# EAGLE design stm32f0discovery_ext (EAGLE 7.3.0)
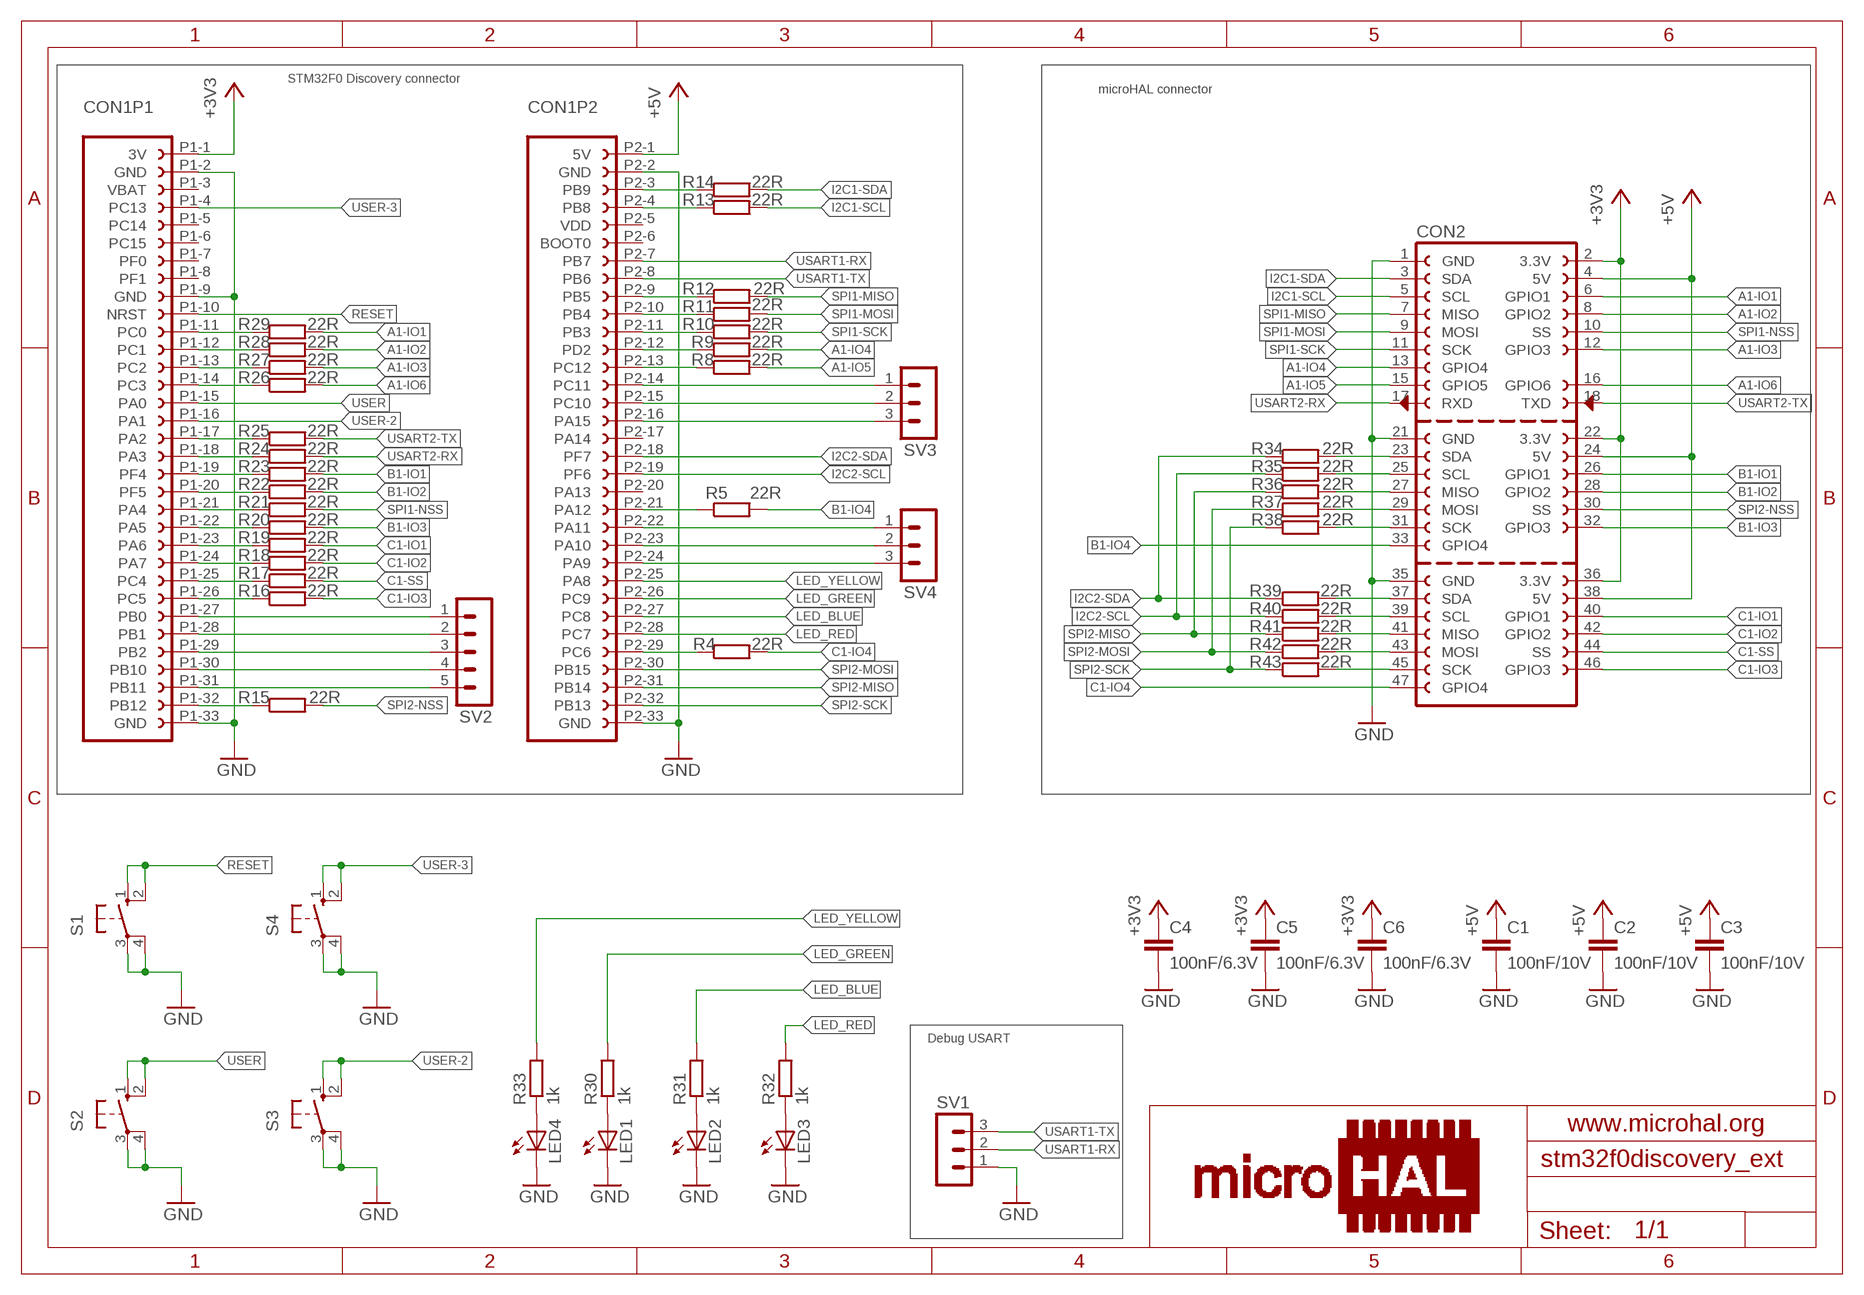
[diagram p0: schematic, sheet 1]

## Parts
C1  100nF/10V  C-EUC0603K  [C0603K]
C2  100nF/10V  C-EUC0603K  [C0603K]
C3  100nF/10V  C-EUC0603K  [C0603K]
C4  100nF/6.3V  C-EUC0603K  [C0603K]
C5  100nF/6.3V  C-EUC0603K  [C0603K]
C6  100nF/6.3V  C-EUC0603K  [C0603K]
CON1  STM32F0-DISCOVERY  [STM32F0-DISCOVERY-CONNECTOR]
CON2  MICROHAL_CONNECTOR_F_3  [MICROHAL_CONNECTOR_F_3]
LED1  LEDCHIPLED_0603  [CHIPLED_0603]
LED2  LEDCHIPLED_0603  [CHIPLED_0603]
LED3  LEDCHIPLED_0603  [CHIPLED_0603]
LED4  LEDCHIPLED_0603  [CHIPLED_0603]
R4  22R  R-EU_R0603  [R0603]
R5  22R  R-EU_R0603  [R0603]
R8  22R  R-EU_R0603  [R0603]
R9  22R  R-EU_R0603  [R0603]
R10  22R  R-EU_R0603  [R0603]
R11  22R  R-EU_R0603  [R0603]
R12  22R  R-EU_R0603  [R0603]
R13  22R  R-EU_R0603  [R0603]
R14  22R  R-EU_R0603  [R0603]
R15  22R  R-EU_R0603  [R0603]
R16  22R  R-EU_R0603  [R0603]
R17  22R  R-EU_R0603  [R0603]
R18  22R  R-EU_R0603  [R0603]
R19  22R  R-EU_R0603  [R0603]
R20  22R  R-EU_R0603  [R0603]
R21  22R  R-EU_R0603  [R0603]
R22  22R  R-EU_R0603  [R0603]
R23  22R  R-EU_R0603  [R0603]
R24  22R  R-EU_R0603  [R0603]
R25  22R  R-EU_R0603  [R0603]
R26  22R  R-EU_R0603  [R0603]
R27  22R  R-EU_R0603  [R0603]
R28  22R  R-EU_R0603  [R0603]
R29  22R  R-EU_R0603  [R0603]
R30  1k  R-EU_R0603  [R0603]
R31  1k  R-EU_R0603  [R0603]
R32  1k  R-EU_R0603  [R0603]
R33  1k  R-EU_R0603  [R0603]
R34  22R  R-EU_R0603  [R0603]
R35  22R  R-EU_R0603  [R0603]
R36  22R  R-EU_R0603  [R0603]
R37  22R  R-EU_R0603  [R0603]
R38  22R  R-EU_R0603  [R0603]
R39  22R  R-EU_R0603  [R0603]
R40  22R  R-EU_R0603  [R0603]
R41  22R  R-EU_R0603  [R0603]
R42  22R  R-EU_R0603  [R0603]
R43  22R  R-EU_R0603  [R0603]
S1  10-XX  [B3F-10XX]
S2  10-XX  [B3F-10XX]
S3  10-XX  [B3F-10XX]
S4  10-XX  [B3F-10XX]
SV1  MA03-1  [MA03-1]
SV2  MA05-1  [MA05-1]
SV3  MA03-1  [MA03-1]
SV4  MA03-1  [MA03-1]

## Nets
+3V3: C4.1 C5.1 C6.1 CON1.P1-1(P1:3V) CON2.2(3.3V) CON2.22(3.3V) CON2.36(3.3V)
+5V: C1.1 C2.1 C3.1 CON1.P2-1(P2:5V) CON2.4(5V) CON2.24(5V) CON2.38(5V)
A1-IO1: CON2.6(GPIO1) R29.2
A1-IO2: CON2.8(GPIO2) R28.2
A1-IO3: CON2.12(GPIO3) R27.2
A1-IO4: CON2.13(GPIO4) R9.2
A1-IO5: CON2.15(GPIO5) R8.2
A1-IO6: CON2.16(GPIO6) R26.2
B1-IO1: CON2.26(GPIO1) R23.2
B1-IO2: CON2.28(GPIO2) R22.2
B1-IO3: CON2.32(GPIO3) R20.2
B1-IO4: CON2.33(GPIO4) R5.2
C1-IO1: CON2.40(GPIO1) R19.2
C1-IO2: CON2.42(GPIO2) R18.2
C1-IO3: CON2.46(GPIO3) R16.2
C1-IO4: CON2.47(GPIO4) R4.2
C1-SS: CON2.44(SS) R17.2
GND: C1.2 C2.2 C3.2 C4.2 C5.2 C6.2 CON1.P1-2(P1:GND) CON1.P1-9(P1:GND) CON1.P1-33(P1:GND) CON1.P2-2(P2:GND) CON1.P2-33(P2:GND) CON2.1(GND) CON2.21(GND) CON2.35(GND) LED1.C LED2.C LED3.C LED4.C S1.3(P) S1.4(P1) S2.3(P) S2.4(P1) S3.3(P) S3.4(P1) S4.3(P) S4.4(P1) SV1.1
I2C1-SCL: CON2.5(SCL) R13.2
I2C1-SDA: CON2.3(SDA) R14.2
I2C2-SCL: CON1.P2-19(P2:PF6) R35.1 R40.1
I2C2-SDA: CON1.P2-18(P2:PF7) R34.1 R39.1
LED_BLUE: CON1.P2-27(P2:PC8) R31.2
LED_GREEN: CON1.P2-26(P2:PC9) R30.2
LED_RED: CON1.P2-28(P2:PC7) R32.2
LED_YELLOW: CON1.P2-25(P2:PA8) R33.2
N$4: CON1.P2-29(P2:PC6) R4.1
N$5: CON1.P2-21(P2:PA12) R5.1
N$8: CON1.P2-13(P2:PC12) R8.1
N$9: CON1.P2-12(P2:PD2) R9.1
N$10: CON1.P2-11(P2:PB3) R10.1
N$11: CON1.P2-10(P2:PB4) R11.1
N$13: CON1.P2-9(P2:PB5) R12.1
N$14: CON1.P2-4(P2:PB8) R13.1
N$15: CON1.P2-3(P2:PB9) R14.1
N$16: CON1.P1-32(P1:PB12) R15.1
N$17: CON1.P1-26(P1:PC5) R16.1
N$18: CON1.P1-25(P1:PC4) R17.1
N$19: CON1.P1-24(P1:PA7) R18.1
N$20: CON1.P1-23(P1:PA6) R19.1
N$21: CON1.P1-22(P1:PA5) R20.1
N$22: CON1.P1-21(P1:PA4) R21.1
N$23: CON1.P1-20(P1:PF5) R22.1
N$24: CON1.P1-19(P1:PF4) R23.1
N$25: CON1.P1-18(P1:PA3) R24.1
N$26: CON1.P1-17(P1:PA2) R25.1
N$27: CON1.P1-14(P1:PC3) R26.1
N$28: CON1.P1-13(P1:PC2) R27.1
N$29: CON1.P1-12(P1:PC1) R28.1
N$30: CON1.P1-11(P1:PC0) R29.1
N$31: LED1.A R30.1
N$32: LED2.A R31.1
N$33: LED3.A R32.1
N$34: LED4.A R33.1
N$35: CON1.P1-27(P1:PB0) SV2.1
N$36: CON1.P1-28(P1:PB1) SV2.2
N$37: CON1.P1-29(P1:PB2) SV2.3
N$38: CON1.P1-30(P1:PB10) SV2.4
N$39: CON1.P1-31(P1:PB11) SV2.5
N$40: CON1.P2-14(P2:PC11) SV3.1
N$41: CON1.P2-15(P2:PC10) SV3.2
N$42: CON1.P2-16(P2:PA15) SV3.3
N$43: CON1.P2-22(P2:PA11) SV4.1
N$44: CON1.P2-23(P2:PA10) SV4.2
N$45: CON1.P2-24(P2:PA9) SV4.3
N$46: CON2.23(SDA) R34.2
N$47: CON2.25(SCL) R35.2
N$48: CON2.27(MISO) R36.2
N$49: CON2.29(MOSI) R37.2
N$50: CON2.31(SCK) R38.2
N$51: CON2.37(SDA) R39.2
N$52: CON2.39(SCL) R40.2
N$53: CON2.41(MISO) R41.2
N$54: CON2.43(MOSI) R42.2
N$55: CON2.45(SCK) R43.2
RESET: CON1.P1-10(P1:NRST) S1.1(S) S1.2(S1)
SPI1-MISO: CON2.7(MISO) R12.2
SPI1-MOSI: CON2.9(MOSI) R11.2
SPI1-NSS: CON2.10(SS) R21.2
SPI1-SCK: CON2.11(SCK) R10.2
SPI2-MISO: CON1.P2-31(P2:PB14) R36.1 R41.1
SPI2-MOSI: CON1.P2-30(P2:PB15) R37.1 R42.1
SPI2-NSS: CON2.30(SS) R15.2
SPI2-SCK: CON1.P2-32(P2:PB13) R38.1 R43.1
USART1-RX: CON1.P2-7(P2:PB7) SV1.2
USART1-TX: CON1.P2-8(P2:PB6) SV1.3
USART2-RX: CON2.17(RXD) R24.2
USART2-TX: CON2.18(TXD) R25.2
USER: CON1.P1-15(P1:PA0) S2.1(S) S2.2(S1)
USER-2: CON1.P1-16(P1:PA1) S3.1(S) S3.2(S1)
USER-3: CON1.P1-4(P1:PC13) S4.1(S) S4.2(S1)
Unconnected: CON1.P1-3(P1:VBAT) CON1.P1-5(P1:PC14) CON1.P1-6(P1:PC15) CON1.P1-7(P1:PF0) CON1.P1-8(P1:PF1) CON1.P2-5(P2:VDD) CON1.P2-6(P2:BOOT0) CON1.P2-17(P2:PA14) CON1.P2-20(P2:PA13)

## Notes on the sheet
- STM32F0 Discovery connector
- microHAL connector
- Debug USART

## Library data of the parts
C1-C6 = rcl:C-EU: CAPACITOR, European symbol
CON1 = stm32f0discovery:STM32F0-DISCOVERY: FEMALE HEADER; OC_FARNELL: unknown; OC_NEWARK: unknown
CON2 = microhal-connector_v0.1:MICROHAL_CONNECTOR_F_3: Connector used in microhal development board.
LED1-LED4 = led:LED: LED OSRAM: - CHIPLED LG R971, LG N971, LY N971, LG Q971, LY Q971, LO R971, LY R971 LH N974, LH R974 LS Q976, LO Q976, LY Q976 LO Q996 - Hyper CHIPLED LW Q18S LB Q993, LB Q99A, LB R99A - SideLED LS A670, LO A670, LY A670, LG A670, LP A670 LB A673, LV A673, LT A673, LW A673 LH A674 LY A675 LS A676, LA A676, LO A676, LY A676, LW A676 LS A679, LY A679, LG A679 - Hyper Micro SIDELED® LS Y876, LA Y876, LO Y876, LY Y876 LT Y87S - SmartLED LW L88C, LW L88S LB L89C, LB L89S, LG L890 LS L89K, LO L89K, LY L89K LS L896, LA L896, LO L896, LY L896 - TOPLED LS T670, LO T670, LY T670, LG T670, LP T670 LSG T670, LSP T670, LSY T670, LOP T670, LYG T670 LG T671, LOG T671, LSG T671 LB T673, LV T673, LT T673, LW T673 LH T674 LS T676, LA T676, LO T676, LY T676, LB T676, LH T676, LSB T676, LW T676 LB T67C, LV T67C, LT T67C, LS T67K, LO T67K, LY T67K, LW E67C LS E67B, LA E67B, LO E67B, LY E67B, LB E67C, LV E67C, LT E67C LW T67C LS T679, LY T679, LG T679 LS T770, LO T770, LY T770, LG T770, LP T770 LB T773, LV T773, LT T773, LW T773 LH T774 LS E675, LA E675, LY E675, LS T675 LS T776, LA T776, LO T776, LY T776, LB T776 LHGB T686 LT T68C, LB T68C - Hyper Mini TOPLED® LB M676 - Mini TOPLED Santana® LG M470 LS M47K, LO M47K, LY M47K Source: http://www.osram.convergy.de LUXEON: - LUMILED® LXK2-PW12-R00, LXK2-PW12-S00, LXK2-PW14-U00, LXK2-PW14-V00 LXK2-PM12-R00, LXK2-PM12-S00, LXK2-PM14-U00 LXK2-PE12-Q00, LXK2-PE12-R00, LXK2-PE12-S00, LXK2-PE14-T00, LXK2-PE14-U00 LXK2-PB12-K00, LXK2-PB12-L00, LXK2-PB12-M00, LXK2-PB14-N00, LXK2-PB14-P00, LXK2-PB14-Q00 LXK2-PR12-L00, LXK2-PR12-M00, LXK2-PR14-Q00, LXK2-PR14-R00 LXK2-PD12-Q00, LXK2-PD12-R00, LXK2-PD12-S00 LXK2-PH12-R00, LXK2-PH12-S00 LXK2-PL12-P00, LXK2-PL12-Q00, LXK2-PL12-R00 Source: www.luxeon.com KINGBRIGHT: KA-3528ASYC Source: www.kingbright.com
R4 R5 R8-R43 = rcl:R-EU_: RESISTOR, European symbol
S1-S4 = switch-omron:10-XX: OMRON SWITCH; MPN: B3F-1000; OC_FARNELL: 176432; OC_NEWARK: 36M3542
SV1 SV3 SV4 = con-lstb:MA03-1: PIN HEADER; OC_FARNELL: unknown; OC_NEWARK: unknown
SV2 = con-lstb:MA05-1: PIN HEADER; OC_FARNELL: unknown; OC_NEWARK: unknown

## Board
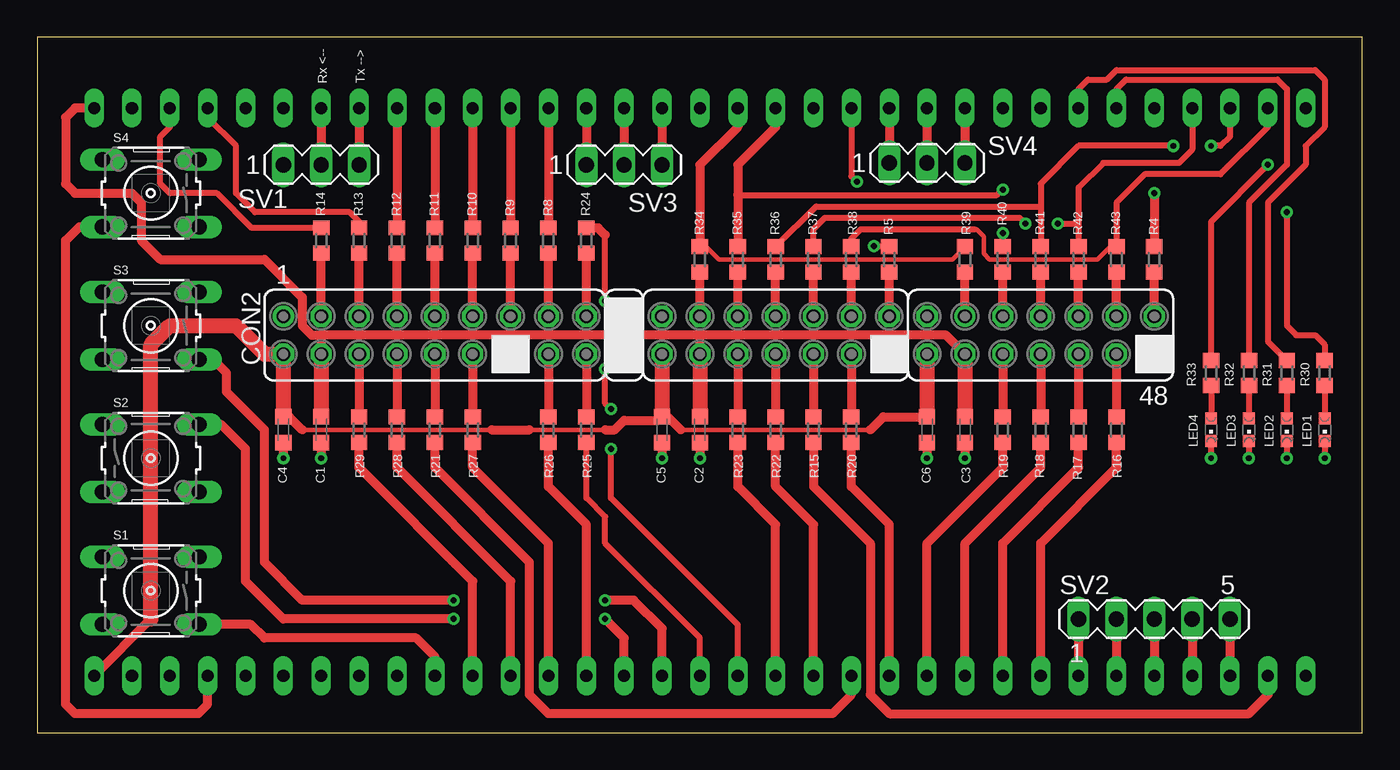
[diagram p1: board, top side]
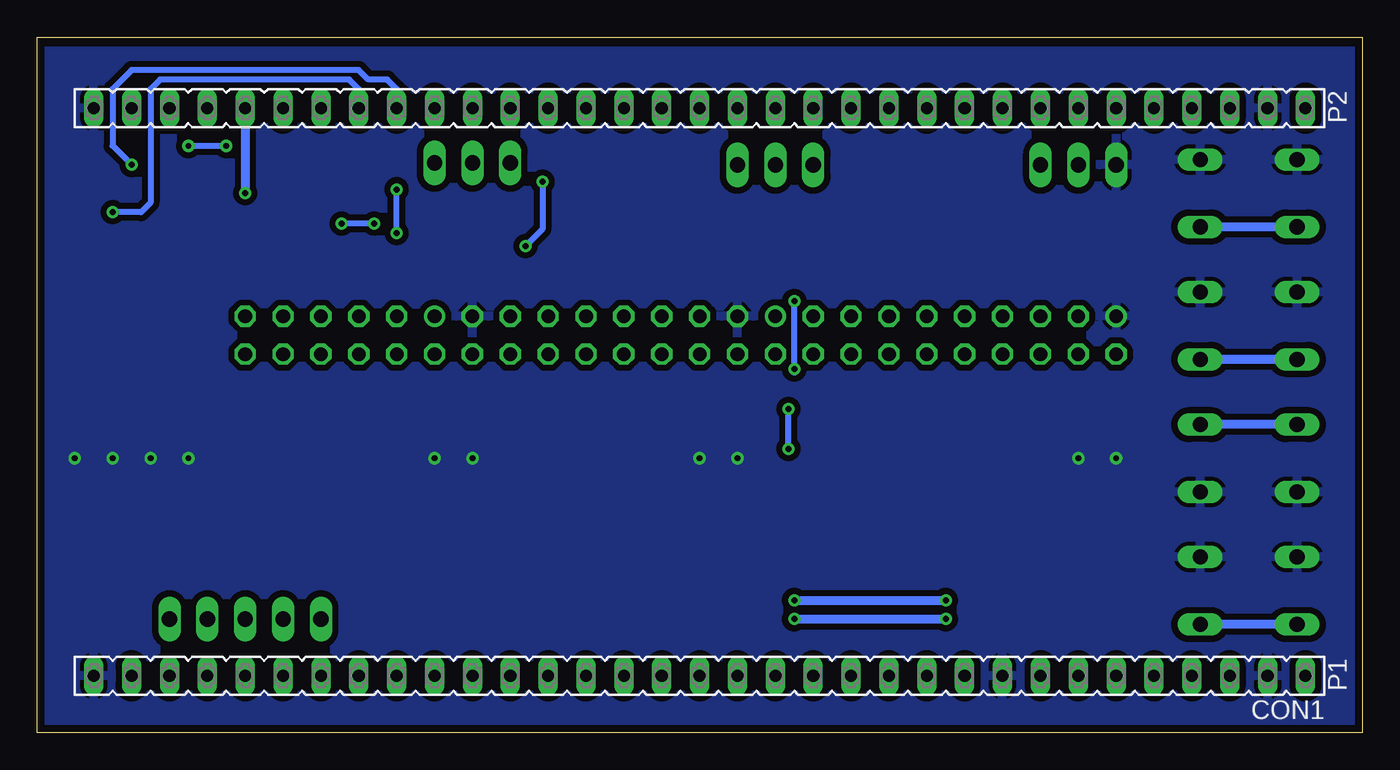
[diagram p2: board, bottom side, seen from below]

Size 88.88 x 46.66 mm. Coordinates in mm from the lower left corner, seen from the top.
Outline: 0,0 88.88,0 88.88,46.66 0,46.66 0,0
Copper layers (1*16): Top 0.035mm / dielectric 1.5mm / Bottom 0.035mm
Design rules "default *": minimum track width 8mil, minimum drill 14mil, track to track 8mil, track to pad 6mil, pad to pad 8mil, via to via 8mil, smd to smd 4mil, copper to edge 20mil, drill to drill 8mil, minimum pad ring 10mil, minimum via ring 8mil, stop-mask expansion 4mil, vias tented up to drill 16mil, thermal gap 10mil

### Footprints (pad centres in the part's own frame; a part is rotated, then mirrored left to right if it is on the bottom)
C0603K = smd 1.05 x 1.08: 1 -0.875,0; 2 0.875,0
STM32F0-DISCOVERY-CONNECTOR = drill 0.813 long: P1-1 19.05,40.64; P1-2 19.05,38.1; P1-3 19.05,35.56; P1-4 19.05,33.02; P1-5 19.05,30.48; P1-6 19.05,27.94; P1-7 19.05,25.4; P1-8 19.05,22.86; P1-9 19.05,20.32; P1-10 19.05,17.78; P1-11 19.05,15.24; P1-12 19.05,12.7; P1-13 19.05,10.16; P1-14 19.05,7.62; P1-15 19.05,5.08; P1-16 19.05,2.54; P1-17 19.05,0; P1-18 19.05,-2.54; P1-19 19.05,-5.08; P1-20 19.05,-7.62; P1-21 19.05,-10.16; P1-22 19.05,-12.7; P1-23 19.05,-15.24; P1-24 19.05,-17.78; P1-25 19.05,-20.32; P1-26 19.05,-22.86; P1-27 19.05,-25.4; P1-28 19.05,-27.94; P1-29 19.05,-30.48; P1-30 19.05,-33.02; P1-31 19.05,-35.56; P1-32 19.05,-38.1; P1-33 19.05,-40.64; P2-1 -19.05,40.64; P2-2 -19.05,38.1; P2-3 -19.05,35.56; P2-4 -19.05,33.02; P2-5 -19.05,30.48; P2-6 -19.05,27.94; P2-7 -19.05,25.4; P2-8 -19.05,22.86; P2-9 -19.05,20.32; P2-10 -19.05,17.78; P2-11 -19.05,15.24; P2-12 -19.05,12.7; P2-13 -19.05,10.16; P2-14 -19.05,7.62; P2-15 -19.05,5.08; P2-16 -19.05,2.54; P2-17 -19.05,0; P2-18 -19.05,-2.54; P2-19 -19.05,-5.08; P2-20 -19.05,-7.62; P2-21 -19.05,-10.16; P2-22 -19.05,-12.7; P2-23 -19.05,-15.24; P2-24 -19.05,-17.78; P2-25 -19.05,-20.32; P2-26 -19.05,-22.86; P2-27 -19.05,-25.4; P2-28 -19.05,-27.94; P2-29 -19.05,-30.48; P2-30 -19.05,-33.02; P2-31 -19.05,-35.56; P2-32 -19.05,-38.1; P2-33 -19.05,-40.64
MICROHAL_CONNECTOR_F_3 = drill 0.914: 1 -33.02,1.27; 19 -10.16,1.27; 37 12.7,1.27 | drill 0.914 octagon: 2 -33.02,-1.27; 3 -30.48,1.27; 4 -30.48,-1.27; 5 -27.94,1.27; 6 -27.94,-1.27; 7 -25.4,1.27; 8 -25.4,-1.27; 9 -22.86,1.27; 10 -22.86,-1.27; 11 -20.32,1.27; 12 -20.32,-1.27; 13 -17.78,1.27; 14 -17.78,-1.27; 15 -15.24,1.27; 16 -15.24,-1.27; 17 -12.7,1.27; 18 -12.7,-1.27; 20 -10.16,-1.27; 21 -7.62,1.27; 22 -7.62,-1.27; 23 -5.08,1.27; 24 -5.08,-1.27; 25 -2.54,1.27; 26 -2.54,-1.27; 27 0,1.27; 28 0,-1.27; 29 2.54,1.27; 30 2.54,-1.27; 31 5.08,1.27; 32 5.08,-1.27; 33 7.62,1.27; 34 7.62,-1.27; 35 10.16,1.27; 36 10.16,-1.27; 38 12.7,-1.27; 39 15.24,1.27; 40 15.24,-1.27; 41 17.78,1.27; 42 17.78,-1.27; 43 20.32,1.27; 44 20.32,-1.27; 45 22.86,1.27; 46 22.86,-1.27; 47 25.4,1.27; 48 25.4,-1.27
CHIPLED_0603 = smd 0.8 x 0.8: A 0,-0.75; C 0,0.75
R0603 = smd 1 x 1.1: 1 -0.85,0; 2 0.85,0
B3F-10XX = drill 1.016 long: 1 -3.251,2.261; 2 3.251,2.261; 3 -3.251,-2.261; 4 3.251,-2.261
MA03-1 = drill 1.016 long: 1 -2.54,0; 2 0,0; 3 2.54,0
MA05-1 = drill 1.016 long: 1 -5.08,0; 2 -2.54,0; 3 0,0; 4 2.54,0; 5 5.08,0

### Placement (x,y rotation side)
C1  19.05,20.32 270 top
C2  44.45,20.32 270 top
C3  62.23,20.32 270 top
C4  16.51,20.32 270 top
C5  41.91,20.32 270 top
C6  59.69,20.32 270 top
CON1  44.45,22.86 270 bottom
CON2  49.53,26.67 0 top
LED1  86.36,20.32 180 top
LED2  83.82,20.32 180 top
LED3  81.28,20.32 180 top
LED4  78.74,20.32 180 top
R4  74.93,31.75 270 top
R5  57.15,31.75 270 top
R8  34.29,33.02 270 top
R9  31.75,33.02 270 top
R10  29.21,33.02 270 top
R11  26.67,33.02 270 top
R12  24.13,33.02 270 top
R13  21.59,33.02 270 top
R14  19.05,33.02 270 top
R15  52.07,20.32 90 top
R16  72.39,20.32 90 top
R17  69.85,20.32 90 top
R18  67.31,20.32 90 top
R19  64.77,20.32 90 top
R20  54.61,20.32 90 top
R21  26.67,20.32 90 top
R22  49.53,20.32 90 top
R23  46.99,20.32 90 top
R24  36.83,33.02 270 top
R25  36.83,20.32 90 top
R26  34.29,20.32 90 top
R27  29.21,20.32 90 top
R28  24.13,20.32 90 top
R29  21.59,20.32 90 top
R30  86.36,24.13 90 top
R31  83.82,24.13 90 top
R32  81.28,24.13 90 top
R33  78.74,24.13 90 top
R34  44.45,31.75 270 top
R35  46.99,31.75 270 top
R36  49.53,31.75 270 top
R37  52.07,31.75 270 top
R38  54.61,31.75 270 top
R39  62.23,31.75 270 top
R40  64.77,31.75 270 top
R41  67.31,31.75 270 top
R42  69.85,31.75 270 top
R43  72.39,31.75 270 top
S1  7.62,9.53 180 top
S2  7.62,18.41 0 top
S3  7.62,27.3 180 top
S4  7.62,36.2 180 top
SV1  19.05,38.1 0 top
SV2  74.93,7.62 0 top
SV3  39.37,38.1 0 top
SV4  59.69,38.23 0 top

### Tracks (layer width: path | path; a pad name or v marks a point on that pad's centre or on a via)
+3V3
  Top 0.305: C4.1 16.91,21.2 | 59.45,20.95 C6.1 | 17.78,20.32 30.48,20.32 | 33.02,20.32 38.1,20.32 | 43.18,20.32 55.88,20.32
  Top 0.61: CON1.P1-1 7.62,7.62 | 16.91,21.2 17.78,20.32 | 30.48,20.32 33.02,20.32 | 38.1,20.32 38.73,20.32 39.37,20.95 41.67,20.95 C5.1 42.3,21.2 43.18,20.32 | 55.88,20.32 56.76,21.2 C6.1
  Top 1.016: 7.62,7.62 7.62,26.04 8.89,27.3 13.34,27.3 15.24,25.4 CON2.2 C4.1 | CON2.36 C6.1 | CON2.22 C5.1
+5V
  Top 0.61: CON1.P2-1 2.54,41.91 1.91,41.27 1.91,36.83 2.54,36.2 6.35,36.2 6.99,35.56 6.99,33.02 8.26,31.75 15.24,31.75 17.78,29.21 17.78,27.3 18.41,26.67 19.05,26.67 | CON2.38 60.96,26.67 44.45,26.67 | 44.45,26.67 19.05,26.67 | 19.05,26.67 CON2.4 | CON2.24 44.45,26.67
  Top 1.016: CON2.38 C3.1 | CON2.24 C2.1 | CON2.4 C1.1
A1-IO1
  Top 0.61: CON2.6 R29.2
A1-IO2
  Top 0.61: CON2.8 R28.2
A1-IO3
  Top 0.61: CON2.12 R27.2
A1-IO4
  Top 0.61: CON2.13 R9.2
A1-IO5
  Top 0.61: CON2.15 R8.2
A1-IO6
  Top 0.61: CON2.16 R26.2
B1-IO1
  Top 0.61: CON2.26 R23.2
B1-IO2
  Top 0.61: CON2.28 R22.2
B1-IO3
  Top 0.61: CON2.32 R20.2
B1-IO4
  Top 0.61: CON2.33 R5.2
C1-IO1
  Top 0.61: CON2.40 R19.2
C1-IO2
  Top 0.61: CON2.42 R18.2
C1-IO3
  Top 0.61: CON2.46 R16.2
C1-IO4
  Top 0.61: CON2.47 R4.2
C1-SS
  Top 0.61: CON2.44 R17.2
GND  (via drill 0.4)
  Top 0.406: v78.74,18.41 LED4.C | LED3.C v81.28,18.41 | LED2.C v83.82,18.41 | LED1.C v86.36,18.41
  Top 0.61: C4.2 v16.51,18.41 | C1.2 v19.05,18.41 | C5.2 v41.91,18.41 | C2.2 v44.45,18.41 | C6.2 v59.69,18.41 | C3.2 v62.23,18.41
  pour Bottom (isolate 0.406): 0,45.72 88.9,45.72 88.9,0 0,0
I2C1-SCL
  Top 0.61: CON2.5 R13.2
I2C1-SDA
  Top 0.61: CON2.3 R14.2
I2C2-SCL  (via drill 0.4)
  Top 0.406: 46.99,36.07 64.39,36.07 v64.77,36.45 | R40.1 v64.77,33.53
  Top 0.61: CON1.P2-19 49.53,40.64 46.99,38.1 46.99,36.07 R35.1
  Bottom 0.406: v64.77,33.53 v64.77,36.45
I2C2-SDA
  Top 0.305: R39.1 61.38,31.75 45.72,31.75 44.87,32.6 R34.1
  Top 0.61: CON1.P2-18 46.99,40.64 44.45,38.1 R34.1
LED_BLUE
  Top 0.406: CON1.P2-27 69.85,43.18 70.48,43.81 71.75,43.81 72.39,44.45 85.72,44.45 86.36,43.81 86.36,40.64 85.09,39.37 85.09,38.1 82.55,35.56 82.55,26.25 R31.2
LED_GREEN  (via drill 0.4)
  Top 0.406: v83.82,34.92 83.82,27.3 84.45,26.67 85.72,26.67 86.36,26.04 R30.2
  Bottom 0.406: CON1.P2-26 67.31,43.18 67.94,43.81 80.64,43.81 81.28,43.18 81.28,35.56 81.92,34.92 v83.82,34.92
LED_RED
  Top 0.406: CON1.P2-28 72.39,43.18 73.03,43.81 83.19,43.81 83.82,43.18 83.82,38.1 81.28,35.56 R32.2
LED_YELLOW  (via drill 0.4)
  Top 0.406: R33.2 78.74,34.29 v82.55,38.1
  Bottom 0.406: CON1.P2-25 64.77,43.18 65.41,43.81 66.67,43.81 67.31,44.45 82.55,44.45 83.82,43.18 83.82,39.37 v82.55,38.1
N$4  (via drill 0.4)
  Top 0.61: v74.93,36.2 R4.1
  Bottom 0.61: CON1.P2-29 v74.93,36.2
N$5  (via drill 0.4)
  Top 0.406: CON1.P2-21 54.61,37.34 v54.99,36.96 | v56.13,32.64 57.11,32.64 R5.1
  Bottom 0.406: v54.99,36.96 54.99,33.78 v56.13,32.64
N$8
  Top 0.61: CON1.P2-13 R8.1
N$9
  Top 0.61: CON1.P2-12 R9.1
N$10
  Top 0.61: CON1.P2-11 R10.1
N$11
  Top 0.61: CON1.P2-10 R11.1
N$13
  Top 0.61: CON1.P2-9 R12.1
N$14
  Top 0.406: R13.1 21.59,34.29 20.95,34.92 14.61,34.92 13.34,36.2 13.34,39.37 11.43,41.27 CON1.P2-4
N$15
  Top 0.406: R14.1 14.39,33.87 12.06,36.2 8.89,36.2 8.26,36.83 8.26,40.01 8.89,40.64 CON1.P2-3
N$16
  Top 0.61: R15.1 52.07,16.51 55.88,12.7 55.88,2.54 57.15,1.27 81.28,1.27 82.55,2.54 CON1.P1-32
N$17
  Top 0.61: CON1.P1-26 67.31,12.7 72.39,17.78 R16.1
N$18
  Top 0.61: CON1.P1-25 64.77,12.7 69.85,17.78 R17.1
N$19
  Top 0.61: CON1.P1-24 62.23,12.7 67.31,17.78 R18.1
N$20
  Top 0.61: CON1.P1-23 59.69,12.7 64.77,17.78 R19.1
N$21
  Top 0.61: CON1.P1-22 57.15,13.97 54.61,16.51 R20.1
N$22
  Top 0.61: CON1.P1-21 54.61,2.54 53.34,1.27 34.29,1.27 33.02,2.54 33.02,11.43 26.67,17.78 R21.1
N$23
  Top 0.61: CON1.P1-20 52.07,13.97 49.53,16.51 R22.1
N$24
  Top 0.61: CON1.P1-19 49.53,13.97 46.99,16.51 R23.1
N$25  (via drill 0.4)
  Top 0.406: CON1.P1-18 46.99,7.24 38.48,15.75 v38.48,19.05 | v38.48,21.72 38.1,22.1 v38.1,24.38 | v38.1,28.96 38.1,33.4
  Top 0.61: 38.1,33.4 37.63,33.87 R24.1
  Bottom 0.406: v38.48,19.05 v38.48,21.72 | v38.1,24.38 v38.1,28.96
  Bottom 0.61: v38.1,24.38 38.1,24.26
N$26
  Top 0.406: CON1.P1-17 44.45,6.35 38.1,12.7 38.1,14.48 36.83,15.75 R25.1
N$27
  Top 0.61: CON1.P1-14 36.83,13.97 34.29,16.51 R26.1
N$28
  Top 0.61: CON1.P1-13 34.29,12.7 29.21,17.78 R27.1
N$29
  Top 0.61: CON1.P1-12 31.75,10.16 24.13,17.78 R28.1
N$30
  Top 0.61: CON1.P1-11 29.21,10.16 21.59,17.78 R29.1
N$31
  Top 0.406: R30.1 LED1.A
N$32
  Top 0.406: R31.1 LED2.A
N$33
  Top 0.406: R32.1 LED3.A
N$34
  Top 0.406: R33.1 LED4.A
N$35
  Top 0.61: SV2.1 CON1.P1-27
N$36
  Top 0.61: SV2.2 CON1.P1-28
N$37
  Top 0.61: SV2.3 CON1.P1-29
N$38
  Top 0.61: SV2.4 CON1.P1-30
N$39
  Top 0.61: SV2.5 CON1.P1-31
N$40
  Top 0.61: CON1.P2-14 SV3.1
N$41
  Top 0.61: CON1.P2-15 SV3.2
N$42
  Top 0.61: CON1.P2-16 SV3.3
N$43
  Top 0.61: CON1.P2-22 SV4.1
N$44
  Top 0.61: CON1.P2-23 SV4.2
N$45
  Top 0.61: CON1.P2-24 SV4.3
N$46
  Top 0.61: CON2.23 R34.2
N$47
  Top 0.61: CON2.25 R35.2
N$48
  Top 0.61: CON2.27 R36.2
N$49
  Top 0.61: CON2.29 R37.2
N$50
  Top 0.61: CON2.31 R38.2
N$51
  Top 0.61: CON2.37 R39.2
N$52
  Top 0.61: CON2.39 R40.2
N$53
  Top 0.61: CON2.41 R41.2
N$54
  Top 0.61: CON2.43 R42.2
N$55
  Top 0.61: CON2.45 R43.2
RESET
  Top 0.61: CON1.P1-10 26.67,5.08 25.4,6.35 15.24,6.35 14.33,7.26 S1.1
  Bottom 0.61: S1.2 S1.1 11.43,7.26
SPI1-MISO
  Top 0.61: CON2.7 R12.2
SPI1-MOSI
  Top 0.61: CON2.9 R11.2
SPI1-NSS
  Top 0.61: CON2.10 R21.2
SPI1-SCK
  Top 0.61: CON2.11 R10.2
SPI2-MISO  (via drill 0.4)
  Top 0.406: CON1.P2-31 80.01,40.01 79.38,39.37 v78.74,39.37 | v76.2,39.37 69.85,39.37 67.31,36.83 67.31,35.31 | R36.1 52.24,35.31 67.31,35.31 | 67.31,35.31 R41.1
  Bottom 0.406: v78.74,39.37 v76.2,39.37
SPI2-MOSI  (via drill 0.4)
  Top 0.406: CON1.P2-30 77.47,39.12 76.58,38.23 71.5,38.23 69.85,36.58 69.85,34.16 | R37.1 52.07,33.78 52.83,34.54 65.91,34.54 v66.29,34.16 | 69.85,34.16 R42.1 | v68.45,34.16 69.85,34.16
  Bottom 0.406: v66.29,34.16 v68.45,34.16
SPI2-NSS
  Top 0.61: CON2.30 R15.2
SPI2-SCK
  Top 0.305: R43.1 71.97,32.6 71.12,31.75 63.88,31.75 63.5,32.13 63.5,33.27 62.99,33.78 62.87,33.78
  Top 0.406: CON1.P2-32 82.55,40.64 79.38,37.47 74.3,37.47 72.39,35.56 R43.1 | R38.1 54.61,33.15 55.24,33.78 62.87,33.78
USART1-RX
  Top 0.61: CON1.P2-7 SV1.2
USART1-TX
  Top 0.61: CON1.P2-8 SV1.3
USART2-RX
  Top 0.61: CON2.17 R24.2
USART2-TX
  Top 0.61: CON2.18 R25.2
USER  (via drill 0.4)
  Top 0.61: S2.2 12.34,20.68 13.97,19.05 13.97,10.16 16.51,7.62 v27.94,7.62 | CON1.P1-15 39.37,6.35 v38.1,7.62
  Bottom 0.61: v38.1,7.62 v27.94,7.62 | S2.1 S2.2
USER-2  (via drill 0.4)
  Top 0.61: CON1.P1-16 41.91,6.99 40.01,8.89 v38.1,8.89 | v27.94,8.89 17.78,8.89 15.24,11.43 15.24,20.32 12.7,22.86 12.7,24.13 11.79,25.04 S3.1
  Bottom 0.61: v38.1,8.89 v27.94,8.89 | S3.2 S3.1
USER-3
  Top 0.61: CON1.P1-4 11.43,1.91 10.79,1.27 2.54,1.27 1.91,1.91 1.91,33.02 2.82,33.93 S4.2
  Bottom 0.61: S4.2 S4.1

### Text on the board
tPlace: Rx <-- | Tx -->